# EAGLE design prototype (EAGLE 6.5.0)
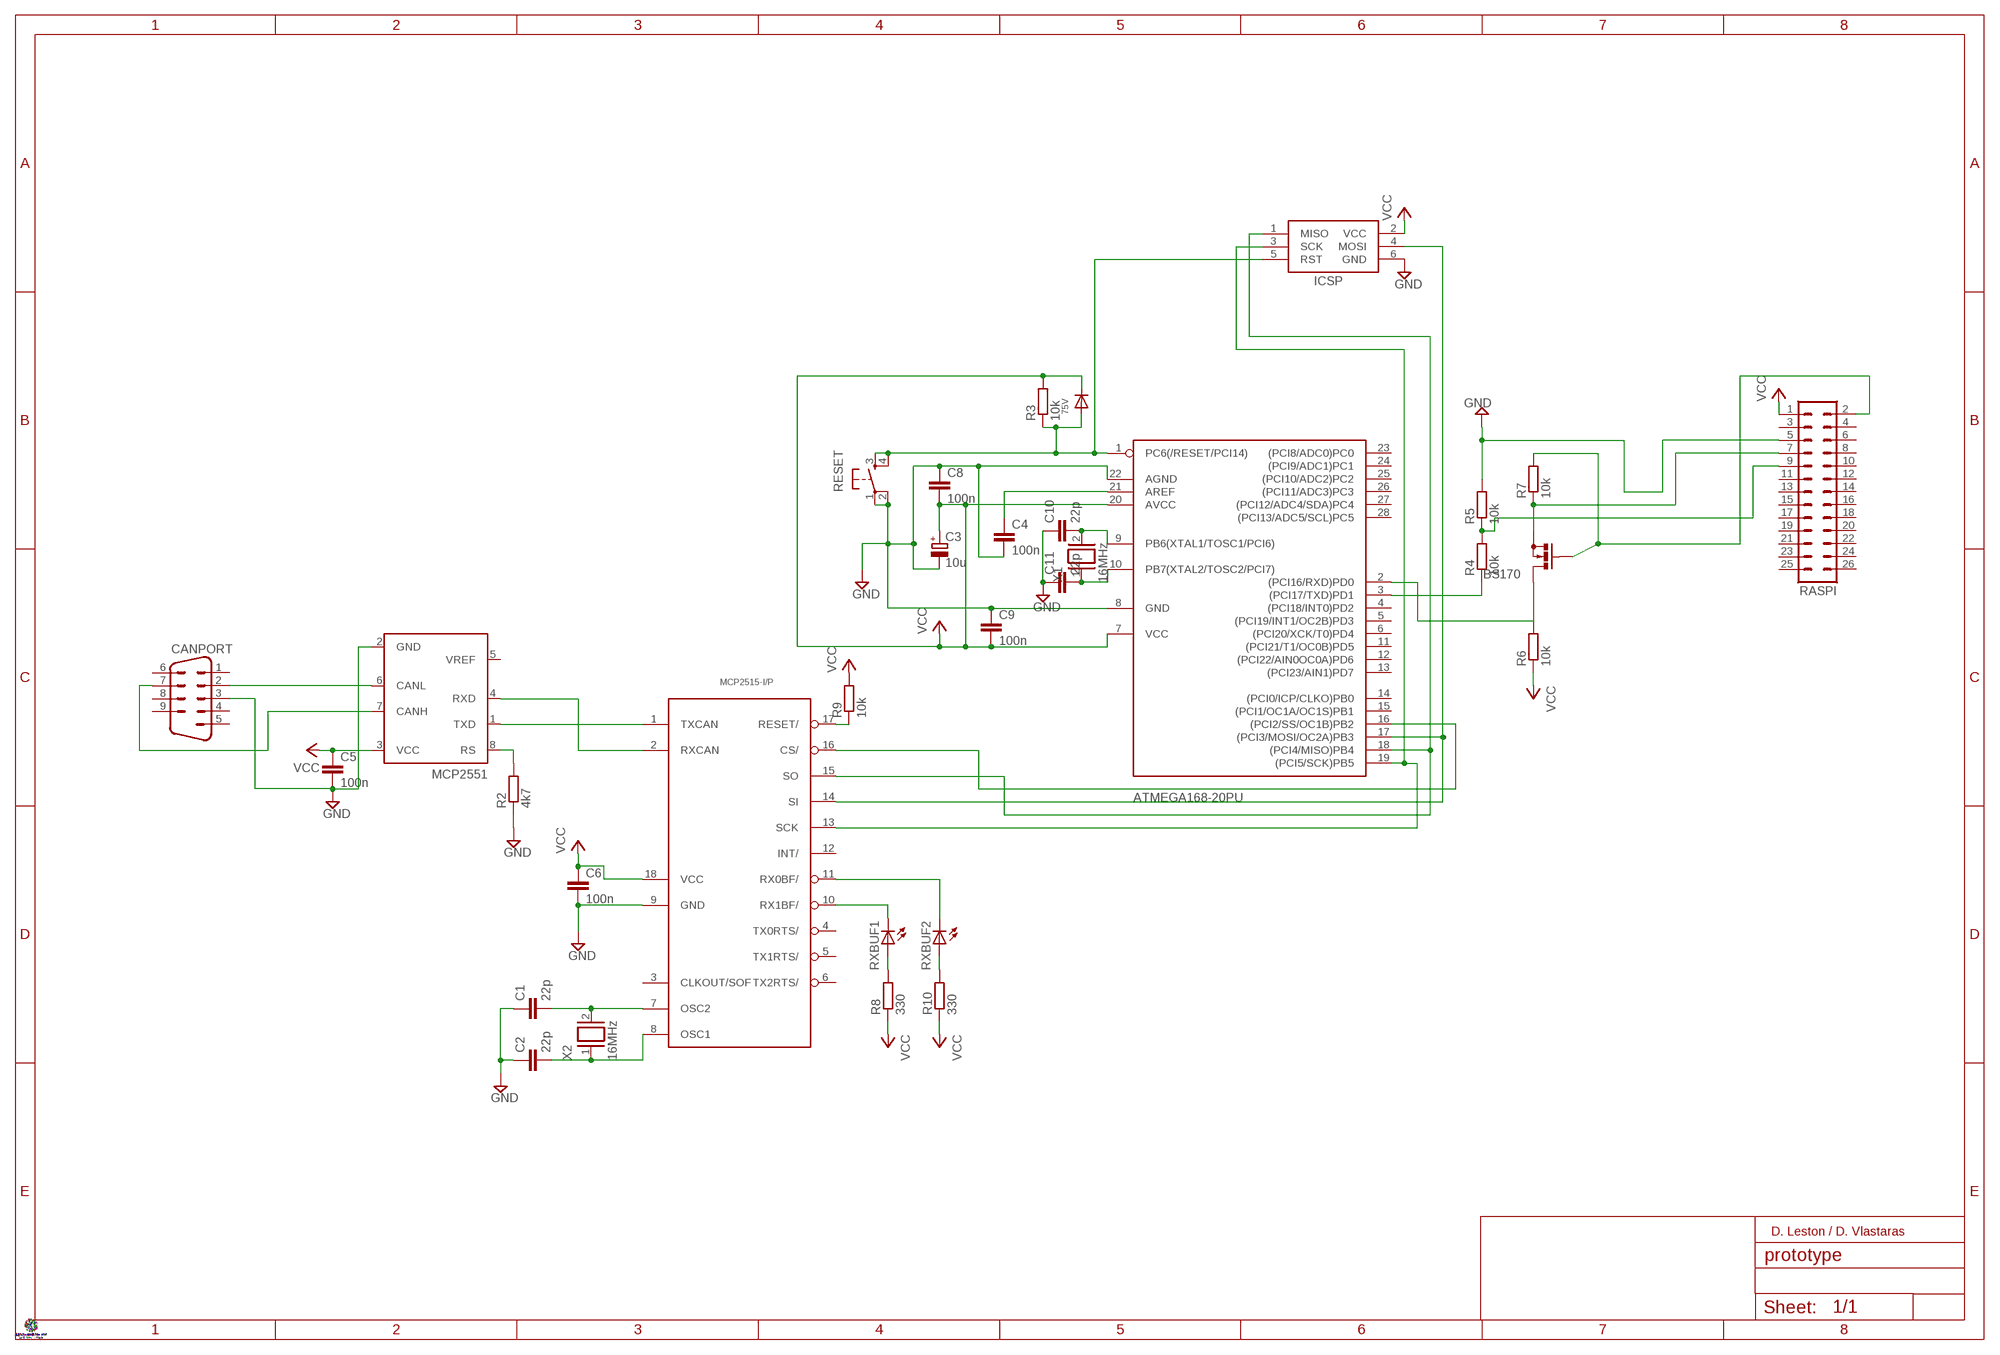
[diagram p0: schematic, sheet 1]

## Parts
75V  DIODEDO-1N4148  [DO-1N4148]
ATMEGA168-20PU  ATMEGA168V-10P  [DIL28-3]
BS170  BS170  [SOT54E]
C1  22p  C-EU050-025X075  [C050-025X075]
C2  22p  C-EU050-025X075  [C050-025X075]
C3  10u  CPOL-EUE2-5  [E2-5]
C4  100n  C-EU050-025X075  [C050-025X075]
C5  100n  C-EU050-025X075  [C050-025X075]
C6  100n  C-EU050-025X075  [C050-025X075]
C8  100n  C-EU050-025X075  [C050-025X075]
C9  100n  C-EU050-025X075  [C050-025X075]
C10  22p  C-EU050-025X075  [C050-025X075]
C11  22p  C-EU050-025X075  [C050-025X075]
CANPORT  M09VP  [M09VP]
ICSP  AVRISP-6  [AVRISP]
MCP2515-I/P  MCP2515DIL  [DIL18]
MCP2551  PCA82C250  [DIL08]
R2  4k7  R-EU_0204/7  [0204/7]
R3  10k  R-EU_0204/7  [0204/7]
R4  10k  R-EU_0204/7  [0204/7]
R5  10k  R-EU_0204/7  [0204/7]
R6  10k  R-EU_0204/7  [0204/7]
R7  10k  R-EU_0204/7  [0204/7]
R8  330  R-EU_0204/7  [0204/7]
R9  10k  R-EU_0204/7  [0204/7]
R10  330  R-EU_0204/7  [0204/7]
RASPI  MA13-2  [MA13-2]
RESET  DTS-6  [DTS-6]
RXBUF1  LED5MM  [LED5MM]
RXBUF2  LED5MM  [LED5MM]
X1  16MHz  XTAL/S  [QS]
X2  16MHz  XTAL/S  [QS]

## Nets
GND: ATMEGA168-20PU.8(GND) ATMEGA168-20PU.22(AGND) C1.1 C2.1 C3.- C4.2 C5.2 C6.2 C8.1 C9.1 C10.1 C11.1 CANPORT.3 ICSP.6(GND) MCP2515-I/P.9(GND) MCP2551.2(GND) R2.1 R5.2 RASPI.5 RESET.1 RESET.2
N$1: MCP2515-I/P.1(TXCAN) MCP2551.1(TXD)
N$2: MCP2515-I/P.2(RXCAN) MCP2551.4(RXD)
N$3: C1.2 MCP2515-I/P.7(OSC2) X2.2
N$4: C2.2 MCP2515-I/P.8(OSC1) X2.1
N$5: MCP2515-I/P.17(RESET/) R9.1
N$6: R8.2 RXBUF1.A
N$7: R10.2 RXBUF2.A
N$8: MCP2515-I/P.11(RX0BF/) RXBUF2.K(C)
N$9: MCP2515-I/P.10(RX1BF/) RXBUF1.K(C)
N$10: ATMEGA168-20PU.16((PCI2/SS/OC1B)PB2) MCP2515-I/P.16(CS/)
N$11: ATMEGA168-20PU.3((PCI17/TXD)PD1) R4.1
N$15: ATMEGA168-20PU.19((PCI5/SCK)PB5) ICSP.3(SCK) MCP2515-I/P.13(SCK)
N$16: ATMEGA168-20PU.9(PB6(XTAL1/TOSC1/PCI6)) C10.2 X1.2
N$17: ATMEGA168-20PU.10(PB7(XTAL2/TOSC2/PCI7)) C11.2 X1.1
N$18: MCP2551.8(RS) R2.2
N$19: ATMEGA168-20PU.21(AREF) C4.1
N$22: R4.2 R5.1 RASPI.9
N$23: ATMEGA168-20PU.2((PCI16/RXD)PD0) BS170.D R6.2
N$24: 75V.A ATMEGA168-20PU.1(PC6(/RESET/PCI14)) ICSP.5(RST) R3.1 RESET.3 RESET.4
N$25: BS170.G R7.2 RASPI.2
N$26: ATMEGA168-20PU.18((PCI4/MISO)PB4) ICSP.1(MISO) MCP2515-I/P.15(SO)
N$27: ATMEGA168-20PU.17((PCI3/MOSI/OC2A)PB3) ICSP.4(MOSI) MCP2515-I/P.14(SI)
N$29: CANPORT.2 MCP2551.6(CANL)
N$30: CANPORT.7 MCP2551.7(CANH)
N$32: BS170.S R7.1 RASPI.7
VCC: 75V.C ATMEGA168-20PU.7(VCC) ATMEGA168-20PU.20(AVCC) C3.+ C5.1 C6.1 C8.2 C9.2 ICSP.2(VCC) MCP2515-I/P.18(VCC) MCP2551.3(VCC) R3.2 R6.1 R8.1 R9.2 R10.1 RASPI.1
Unconnected: ATMEGA168-20PU.4((PCI18/INT0)PD2) ATMEGA168-20PU.5((PCI19/INT1/OC2B)PD3) ATMEGA168-20PU.6((PCI20/XCK/T0)PD4) ATMEGA168-20PU.11((PCI21/T1/OC0B)PD5) ATMEGA168-20PU.12((PCI22/AIN0OC0A)PD6) ATMEGA168-20PU.13((PCI23/AIN1)PD7) ATMEGA168-20PU.14((PCI0/ICP/CLKO)PB0) ATMEGA168-20PU.15((PCI1/OC1A/OC1S)PB1) ATMEGA168-20PU.23((PCI8/ADC0)PC0) ATMEGA168-20PU.24((PCI9/ADC1)PC1) ATMEGA168-20PU.25((PCI10/ADC2)PC2) ATMEGA168-20PU.26((PCI11/ADC3)PC3) ATMEGA168-20PU.27((PCI12/ADC4/SDA)PC4) ATMEGA168-20PU.28((PCI13/ADC5/SCL)PC5) CANPORT.1 CANPORT.4 CANPORT.5 CANPORT.6 CANPORT.8 CANPORT.9 MCP2515-I/P.3(CLKOUT/SOF) MCP2515-I/P.4(TX0RTS/) MCP2515-I/P.5(TX1RTS/) MCP2515-I/P.6(TX2RTS/) MCP2515-I/P.12(INT/) MCP2551.5(VREF) RASPI.3 RASPI.4 RASPI.6 RASPI.8 RASPI.10 RASPI.11 RASPI.12 RASPI.13 RASPI.14 RASPI.15 RASPI.16 RASPI.17 RASPI.18 RASPI.19 RASPI.20 RASPI.21 RASPI.22 RASPI.23 RASPI.24 RASPI.25 RASPI.26

## Library data of the parts
75V = adafruit:DIODE: Diode SMADIODE - SMA Surface Mount Package 20V 1A Schottky Diode Digikey: 641-1014-6-ND DO-1N4148 - Through Hole Small Current Diode SOD-123 20V 1 A (.5mV Vf) Schottky Diode - Digikey: MBRX120TPMSCT-ND SOD-323 10V 570mA (.38mV Vf, 3ns) Schottky Diode - Digikey: ZLLS410CT-ND SOD-523 30V 30mA Schottky Diode (RB751S-40TE61) - Digikey: RB751S-40TE61CT-ND SOT23-R/W - SOT23 Package (R = Solder Paste/Reflow Ovens, W = Hand-Soldering) BAT54Film 40V 300mA - Digikey: 497-7162-1-ND
ATMEGA168-20PU = adafruit:ATMEGA168*P: MICROCONTROLLER 16 kBytes FLASH 1 kBytes SRAM 512 Bytes EEPROM USART 8-channel 10 bit ADC
BS170 = transistor-small-signal:BS170: N-CHANNEL MOS FET
C1 C2 C4-C6 C8-C11 = rcl:C-EU: CAPACITOR, European symbol
C3 = rcl:CPOL-EU: POLARIZED CAPACITOR, European symbol
CANPORT = con-subd:M09: SUB-D; OC_FARNELL: unknown; OC_NEWARK: unknown
ICSP = adafruit:AVRISP: AVR ISP HEADER Standard 6 pin header for AVR programming
MCP2515-I/P = MCP2515_MT:MCP2515*: MCP2515 Standalone CAN-Controller by Microchip Eagle-Lib. by MartinThomas
MCP2551 = micro-philips:PCA82C250: CAN CONTROLLER INTERFACE; OC_FARNELL: 3692358; OC_NEWARK: unknown
R2-R10 = rcl:R-EU_: RESISTOR, European symbol
RASPI = con-lstb:MA13-2: PIN HEADER; OC_FARNELL: unknown; OC_NEWARK: unknown
RESET = switch-tact:DTS-6
RXBUF1 RXBUF2 = led:LED: LED OSRAM: - CHIPLED LG R971, LG N971, LY N971, LG Q971, LY Q971, LO R971, LY R971 LH N974, LH R974 LS Q976, LO Q976, LY Q976 LO Q996 - Hyper CHIPLED LW Q18S LB Q993, LB Q99A, LB R99A - SideLED LS A670, LO A670, LY A670, LG A670, LP A670 LB A673, LV A673, LT A673, LW A673 LH A674 LY A675 LS A676, LA A676, LO A676, LY A676, LW A676 LS A679, LY A679, LG A679 - Hyper Micro SIDELED® LS Y876, LA Y876, LO Y876, LY Y876 LT Y87S - SmartLED LW L88C, LW L88S LB L89C, LB L89S, LG L890 LS L89K, LO L89K, LY L89K LS L896, LA L896, LO L896, LY L896 - TOPLED LS T670, LO T670, LY T670, LG T670, LP T670 LSG T670, LSP T670, LSY T670, LOP T670, LYG T670 LG T671, LOG T671, LSG T671 LB T673, LV T673, LT T673, LW T673 LH T674 LS T676, LA T676, LO T676, LY T676, LB T676, LH T676, LSB T676, LW T676 LB T67C, LV T67C, LT T67C, LS T67K, LO T67K, LY T67K, LW E67C LS E67B, LA E67B, LO E67B, LY E67B, LB E67C, LV E67C, LT E67C LW T67C LS T679, LY T679, LG T679 LS T770, LO T770, LY T770, LG T770, LP T770 LB T773, LV T773, LT T773, LW T773 LH T774 LS E675, LA E675, LY E675, LS T675 LS T776, LA T776, LO T776, LY T776, LB T776 LHGB T686 LT T68C, LB T68C - Hyper Mini TOPLED® LB M676 - Mini TOPLED Santana® LG M470 LS M47K, LO M47K, LY M47K Source: http://www.osram.convergy.de LUXEON: - LUMILED® LXK2-PW12-R00, LXK2-PW12-S00, LXK2-PW14-U00, LXK2-PW14-V00 LXK2-PM12-R00, LXK2-PM12-S00, LXK2-PM14-U00 LXK2-PE12-Q00, LXK2-PE12-R00, LXK2-PE12-S00, LXK2-PE14-T00, LXK2-PE14-U00 LXK2-PB12-K00, LXK2-PB12-L00, LXK2-PB12-M00, LXK2-PB14-N00, LXK2-PB14-P00, LXK2-PB14-Q00 LXK2-PR12-L00, LXK2-PR12-M00, LXK2-PR14-Q00, LXK2-PR14-R00 LXK2-PD12-Q00, LXK2-PD12-R00, LXK2-PD12-S00 LXK2-PH12-R00, LXK2-PH12-S00 LXK2-PL12-P00, LXK2-PL12-Q00, LXK2-PL12-R00 Source: www.luxeon.com KINGBRIGHT: KA-3528ASYC Source: www.kingbright.com
X1 X2 = special:XTAL/S: CRYSTAL

## Board
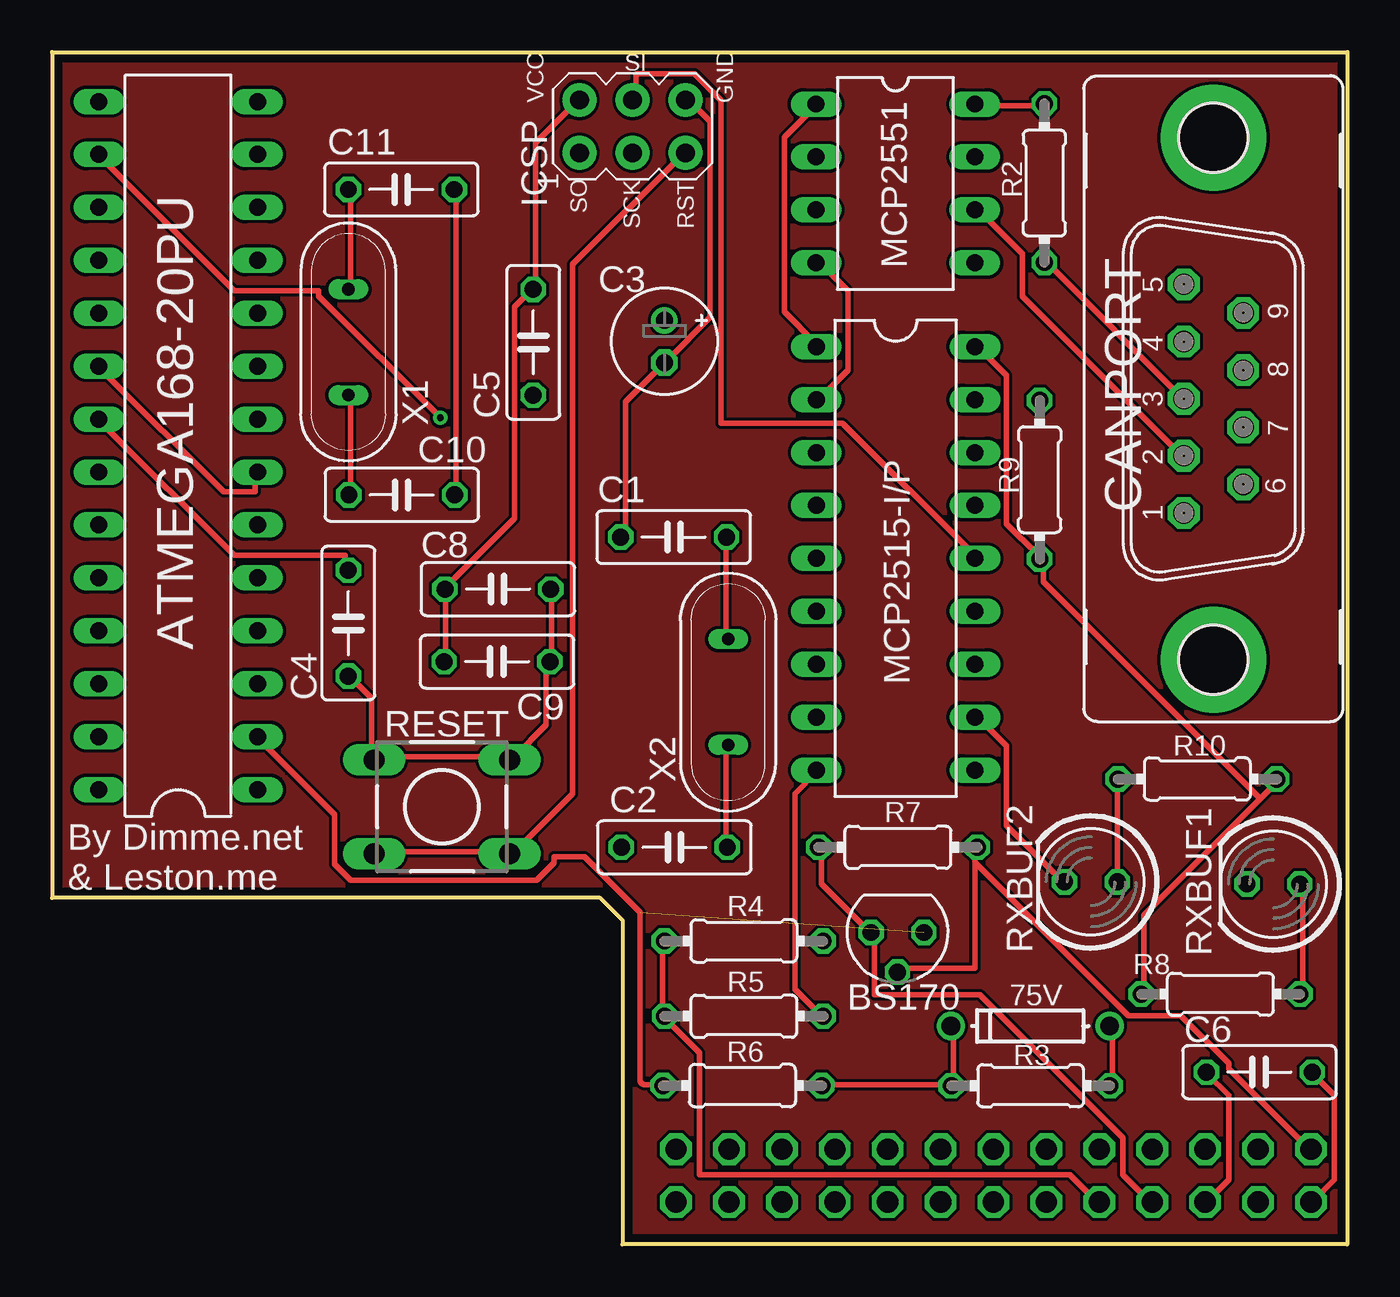
[diagram p1: board, top side]
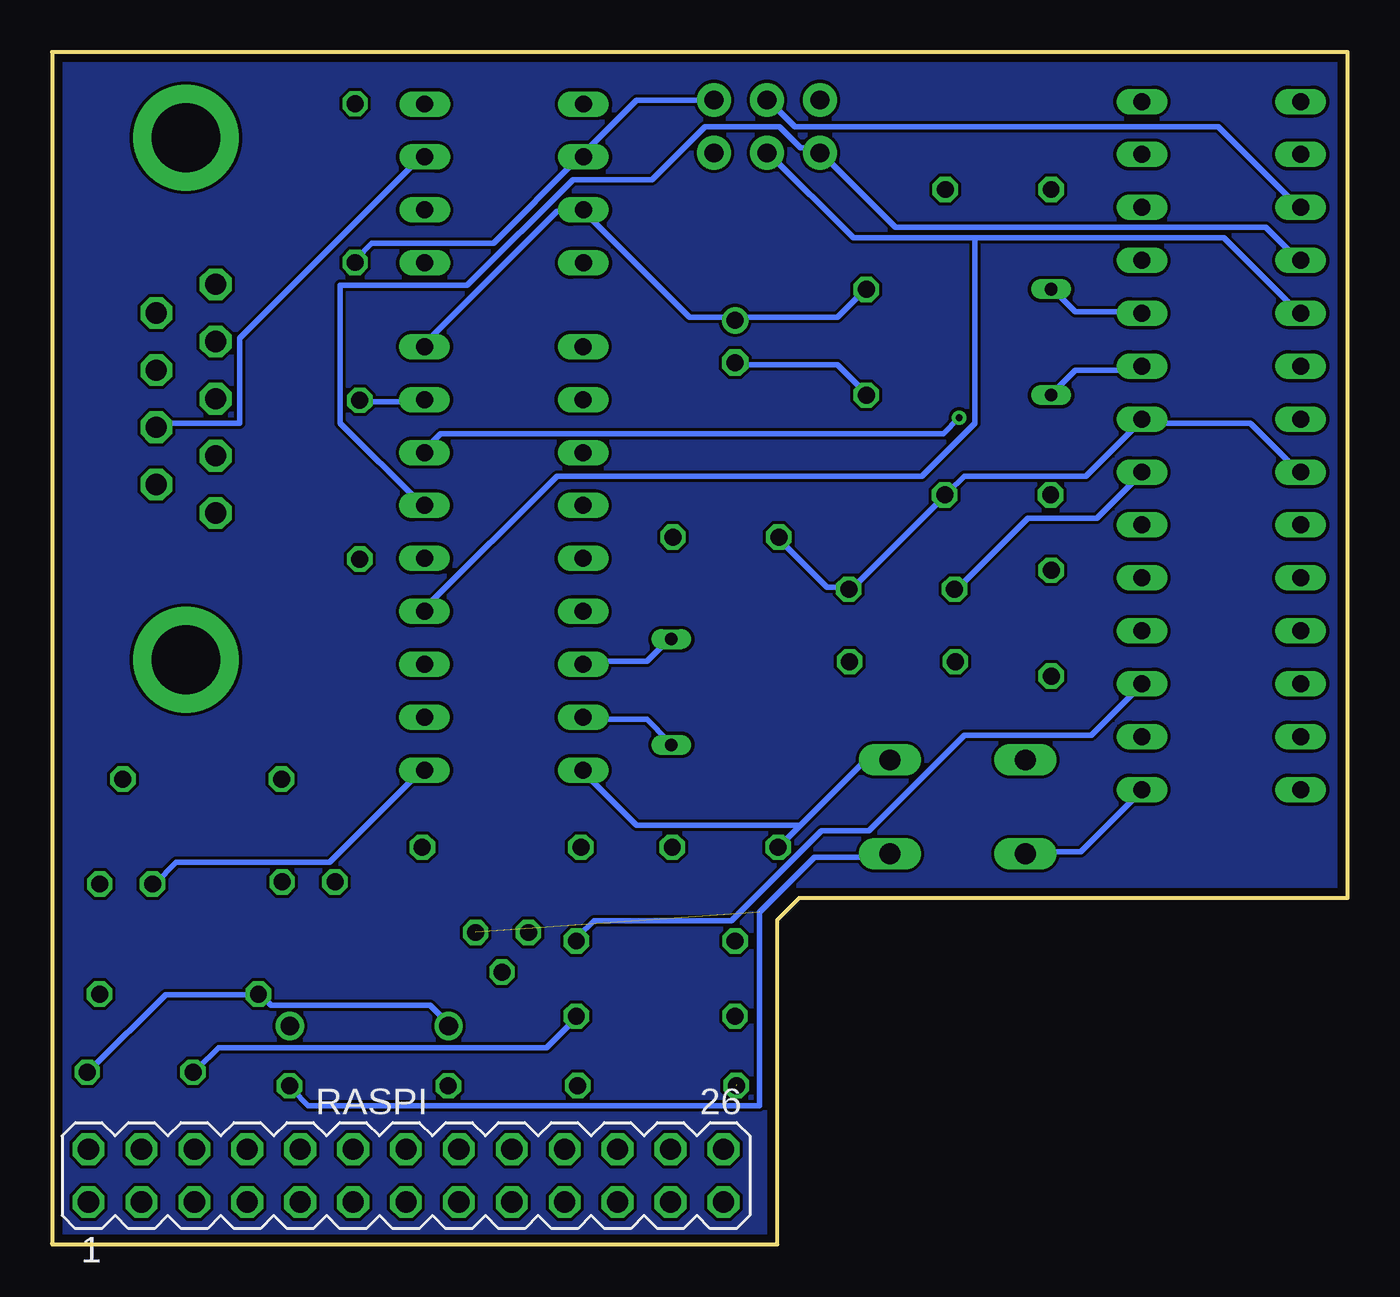
[diagram p2: board, bottom side, seen from below]

Size 62.19 x 57.23 mm. Coordinates in mm from the lower left corner, seen from the top.
Outline: 0,57.23 62.19,57.23 62.19,0.05
Outline: 62.18,0 27.38,0 27.38,15.57 26.31,16.64 0,16.64 0,57.2
Copper layers (1*16): Top 0.0356mm / dielectric 1.5011mm / Bottom 0.0356mm
Design rules "LaenPCBOrder *": minimum track width 10mil, minimum drill 13mil, track to track 6mil, track to pad 6mil, pad to pad 6mil, via to via 6mil, smd to smd 6mil, copper to edge 15mil, drill to drill 6mil, minimum pad ring 7mil, minimum via ring 7mil, stop-mask expansion 3mil, vias tented up to drill 0mil, thermal gap 10mil

### Footprints (pad centres in the part's own frame; a part is rotated, then mirrored left to right if it is on the bottom)
DO-1N4148 = drill 0.9: A -3.81,0; C 3.81,0
DIL28-3 = drill 0.813 long: 1 -16.51,-3.81; 2 -13.97,-3.81; 3 -11.43,-3.81; 4 -8.89,-3.81; 5 -6.35,-3.81; 6 -3.81,-3.81; 7 -1.27,-3.81; 8 1.27,-3.81; 9 3.81,-3.81; 10 6.35,-3.81; 11 8.89,-3.81; 12 11.43,-3.81; 13 13.97,-3.81; 14 16.51,-3.81; 15 16.51,3.81; 16 13.97,3.81; 17 11.43,3.81; 18 8.89,3.81; 19 6.35,3.81; 20 3.81,3.81; 21 1.27,3.81; 22 -1.27,3.81; 23 -3.81,3.81; 24 -6.35,3.81; 25 -8.89,3.81; 26 -11.43,3.81; 27 -13.97,3.81; 28 -16.51,3.81
SOT54E = drill 0.813 octagon: D -1.27,0; G 0,1.905; S 1.27,0
C050-025X075 = drill 0.813 octagon: 1 -2.54,0; 2 2.54,0
E2-5 = drill 0.813 pad 1.27: + -1.016,0 | drill 0.813 pad 1.27 octagon: - 1.016,0
M09VP = drill 1.016 octagon: 1 -5.486,1.422; 2 -2.743,1.422; 3 0,1.422; 4 2.743,1.422; 5 5.486,1.422; 6 -4.115,-1.422; 7 -1.372,-1.422; 8 1.372,-1.422; 9 4.115,-1.422 | drill 3.302 pad 5.08: G1 -12.522,0; G2 12.522,0
AVRISP = drill 0.9 pad 1.626: 1 -1.27,2.54; 2 1.27,2.54; 3 -1.27,0; 4 1.27,0; 5 -1.27,-2.54; 6 1.27,-2.54
DIL18 = drill 0.813 long: 1 -10.16,-3.81; 2 -7.62,-3.81; 3 -5.08,-3.81; 4 -2.54,-3.81; 5 0,-3.81; 6 2.54,-3.81; 7 5.08,-3.81; 8 7.62,-3.81; 9 10.16,-3.81; 10 10.16,3.81; 11 7.62,3.81; 12 5.08,3.81; 13 2.54,3.81; 14 0,3.81; 15 -2.54,3.81; 16 -5.08,3.81; 17 -7.62,3.81; 18 -10.16,3.81
DIL08 = drill 0.813 long: 1 -3.81,-3.81; 2 -1.27,-3.81; 3 1.27,-3.81; 4 3.81,-3.81; 5 3.81,3.81; 6 1.27,3.81; 7 -1.27,3.81; 8 -3.81,3.81
0204/7 = drill 0.813 octagon: 1 -3.81,0; 2 3.81,0
MA13-2 = drill 1.016 octagon: 1 -15.24,-1.27; 2 -15.24,1.27; 3 -12.7,-1.27; 4 -12.7,1.27; 5 -10.16,-1.27; 6 -10.16,1.27; 7 -7.62,-1.27; 8 -7.62,1.27; 9 -5.08,-1.27; 10 -5.08,1.27; 11 -2.54,-1.27; 12 -2.54,1.27; 13 0,-1.27; 14 0,1.27; 15 2.54,-1.27; 16 2.54,1.27; 17 5.08,-1.27; 18 5.08,1.27; 19 7.62,-1.27; 20 7.62,1.27; 21 10.16,-1.27; 22 10.16,1.27; 23 12.7,-1.27; 24 12.7,1.27; 25 15.24,-1.27; 26 15.24,1.27
DTS-6 = drill 1 long: 1 -3.25,2.25; 2 3.25,2.25; 3 -3.25,-2.25; 4 3.25,-2.25
LED5MM = drill 0.813 octagon: A -1.27,0; K 1.27,0
QS = drill 0.61 long: 1 -2.54,0; 2 2.54,0

### Placement (x,y rotation side)
75V  46.96,10.48 180 top
ATMEGA168-20PU  6.06,38.34 90 top
BS170  40.59,14.97 180 top
C1  29.84,33.95 0 top
C2  29.87,19.06 0 top
C3  29.4,43.34 270 top
C4  14.22,29.82 270 top
C5  23.1,43.3 270 top
C6  57.96,8.27 180 top
C8  21.4,31.45 180 top
C9  21.36,27.97 180 top
C10  16.79,35.98 180 top
C11  16.77,50.63 180 top
CANPORT  55.76,40.59 90 top
ICSP  27.87,53.66 90 top
MCP2515-I/P  40.5,32.93 270 top
MCP2551  40.49,50.92 270 top
R2  47.64,50.94 90 top
R3  46.98,7.62 180 top
R4  33.21,14.56 180 top
R5  33.21,10.95 0 top
R6  33.15,7.62 180 top
R7  40.61,19.06 0 top
R8  56.1,12.01 0 top
R9  47.42,36.7 270 top
R10  54.98,22.34 180 top
RASPI  45.2,3.3 0 bottom
RESET  18.72,21 0 top
RXBUF1  58.63,17.3 180 top
RXBUF2  49.87,17.4 180 top
X1  14.22,43.31 270 top
X2  32.46,26.52 90 top

### Tracks (layer width: path | path; a pad name or v marks a point on that pad's centre or on a via)
GND
  Top 0.254: C6.2 55.47,8.18 56.49,7.16 56.49,3.1 55.47,2.08 RASPI.5 | C4.2 14.33,27.23 15.34,26.21 15.34,23.42 RESET.1 15.6,23.42 21.95,23.42 RESET.2 22.2,23.42 23.72,24.94 23.72,27.74 C9.1 23.98,27.99 23.98,31.29 C8.1 | R5.2 36.93,10.97 35.66,12.24 35.66,21.64 36.68,22.66 MCP2515-I/P.9 | R2.1 47.85,47.04 54.2,40.69 CANPORT.3 | C11.1 19.41,50.6 19.41,36.12 C10.1 | C1.1 27.53,34.09 27.53,40.44 29.31,42.21 C3.- 29.57,42.47 31.6,44.5 31.6,53.9 30.58,54.91 ICSP.6
  Bottom 0.254: 26.26,20.12 23.22,23.16 22.2,23.16 RESET.2 | 26.26,20.12 27.28,19.1 C2.1 | 26.26,20.12 34.14,20.12 36.68,22.66 MCP2515-I/P.9 | C6.2 55.22,8.43 54.2,9.45 38.46,9.45 37.19,10.72 R5.2 | ICSP.6 30.58,54.91 34.14,54.91 36.68,52.37 MCP2551.2 36.93,52.12 41,48.06 46.84,48.06 47.6,47.29 R2.1 | ATMEGA168-20PU.22 2.39,37.13 4.67,39.42 9.75,39.42 ATMEGA168-20PU.8 10.01,39.42 12.55,36.88 18.39,36.88 19.15,36.12 C10.1 19.41,35.86 23.72,31.55 C8.1 23.98,31.55 24.99,31.55 27.28,33.83 C1.1 | C5.2 23.22,40.94 24.49,42.21 29.31,42.21 C3.-
N$1
  Top 0.254: MCP2515-I/P.1 36.68,43.23 35.15,44.75 35.15,53.14 36.68,54.66 MCP2551.1
N$2
  Top 0.254: MCP2551.4 36.93,47.04 38.2,45.77 38.2,41.96 36.93,40.69 MCP2515-I/P.2
N$3
  Top 0.254: C1.2 32.36,33.83 32.36,29.26 X2.2
  Bottom 0.254: X2.2 32.61,29.01 33.63,27.99 36.68,27.99 MCP2515-I/P.7
N$4
  Top 0.254: C2.2 32.36,19.1 32.36,23.93 X2.1
  Bottom 0.254: X2.1 32.61,24.18 33.63,25.2 36.68,25.2 MCP2515-I/P.8
N$5
  Bottom 0.254: R9.1 47.35,40.44 44.55,40.44 MCP2515-I/P.17
N$6
  Top 0.254: RXBUF1.A 60.05,17.07 60.05,12.24 R8.2
N$7
  Top 0.254: RXBUF2.A 51.16,17.58 51.16,22.15 R10.2
N$8
  Top 0.254: RXBUF2.K 48.36,17.58 45.82,20.12 45.82,23.93 44.55,25.2 MCP2515-I/P.11
N$9
  Bottom 0.254: MCP2515-I/P.10 44.55,22.66 48.87,18.34 56.24,18.34 57.25,17.32 RXBUF1.K
N$10  (via drill 0.33)
  Top 0.254: v18.64,39.67 12.8,45.52 12.8,45.77 8.74,45.77 2.39,52.12 ATMEGA168-20PU.16
  Bottom 0.254: v18.64,39.67 19.41,38.91 43.54,38.91 44.3,38.15 MCP2515-I/P.16
N$11
  Bottom 0.254: ATMEGA168-20PU.3 10.01,26.72 12.29,24.43 18.39,24.43 22.96,19.86 25.25,19.86 29.57,15.54 36.17,15.54 36.93,14.78 R4.1
N$12
  pour Top: 0.1,17.5 0.79,16.81 26.39,16.81 27.51,15.7 27.51,0.84 28.24,0.1 61.47,0.1 62.05,0.69 62.05,56.54 61.47,57.12 0.79,57.12 0.13,56.46
N$13
  pour Bottom: 0.13,56.44 0.13,17.48 0.84,16.76 26.37,16.76 27.51,15.62 27.51,0.84 28.27,0.08 61.44,0.08 62.1,0.74 62.1,56.49 61.47,57.12 0.79,57.12 0.13,56.46
N$15
  Bottom 0.254: 17.88,48.31 23.72,48.31 27.79,52.37 ICSP.3 | 17.88,48.31 5.94,48.31 2.39,44.75 ATMEGA168-20PU.19 | 17.88,48.31 17.88,39.42 20.42,36.88 37.95,36.88 44.3,30.53 MCP2515-I/P.13
N$16
  Top 0.254: C10.2 14.33,36.12 14.33,40.69 X1.2
  Bottom 0.254: X1.2 14.07,40.94 13.06,41.96 10.01,41.96 ATMEGA168-20PU.9
N$17
  Top 0.254: C11.2 14.33,50.6 14.33,46.02 X1.1
  Bottom 0.254: X1.1 14.07,45.77 13.06,44.75 10.01,44.75 ATMEGA168-20PU.10
N$18
  Top 0.254: MCP2551.8 44.55,54.66 47.6,54.66 R2.2
N$19
  Top 0.254: ATMEGA168-20PU.21 2.39,39.42 8.74,33.07 14.07,33.07 14.07,32.56 C4.1
N$22
  Top 0.254: R4.2 29.31,14.53 29.31,10.97 R5.1 29.57,10.72 31.09,9.19 31.09,3.35 48.87,3.35 50.14,2.08 RASPI.9
N$23  (2 unrouted)
  Top 0.254: ATMEGA168-20PU.2 10.01,24.18 13.56,20.62 13.56,18.24 14.33,17.48 23.27,17.48 24.1,18.31 24.1,18.62 25.55,18.62 28.22,15.95 28.22,7.92 arc90 28.47,7.67 29.31,7.67
N$24
  Top 0.254: R3.1 50.9,7.67 50.9,10.46 75V.A | RESET.3 15.6,18.85 21.95,18.85 RESET.4 22.2,18.85 24.99,21.64 24.99,47.04 30.33,52.37 ICSP.5
  Bottom 0.254: ATMEGA168-20PU.1 10.01,21.64 12.8,18.85 15.34,18.85 RESET.3 | R3.1 50.65,7.42 49.89,6.65 28.22,6.65 28.22,15.95 25.58,18.59 22.2,18.59 RESET.4
N$25
  Top 0.254: 44.3,18.34 44.3,18.85 R7.2 | 44.3,18.34 44.3,13.26 40.74,13.26 BS170.G | 44.3,18.34 51.66,10.97 54.2,10.97 56.49,8.69 56.49,8.43 60.3,4.62 RASPI.2
N$26
  Bottom 0.254: ATMEGA168-20PU.18 2.39,47.29 3.91,48.82 21.69,48.82 25.25,52.37 ICSP.1 25.5,52.63 26.26,52.63 27.28,53.64 30.84,53.64 33.38,51.1 37.19,51.1 42.27,46.02 48.36,46.02 48.36,39.42 44.55,35.61 MCP2515-I/P.15
N$27
  Top 0.254: MCP2515-I/P.14 44.3,33.07 37.95,39.42 32.11,39.42 32.11,54.91 30.84,56.18 28.04,56.18 28.04,55.17 ICSP.4
  Bottom 0.254: ATMEGA168-20PU.17 2.39,49.83 6.2,53.64 26.52,53.64 27.79,54.91 ICSP.4
N$29
  Top 0.254: MCP2551.6 44.55,49.58 46.58,47.55 46.58,45.52 54.2,37.9 CANPORT.2
N$30
  Bottom 0.254: MCP2551.7 44.55,52.12 53.19,43.48 53.19,39.42 57,39.42 CANPORT.7
N$32
  Top 0.254: R7.1 36.93,18.85 36.93,17.32 39.22,15.04 BS170.S 39.47,14.78 39.47,11.99 44.55,11.99 51.41,5.13 51.41,3.35 52.68,2.08 RASPI.7
VCC
  Top 0.254: 75V.C 43.28,10.46 43.28,7.67 R3.2 43.03,7.67 37.19,7.67 R6.1 | 58.01,21.39 52.43,15.8 52.43,12.24 R8.1 | 58.01,21.39 58.78,22.15 R10.1 | RASPI.1 60.55,2.08 61.57,3.1 61.57,7.16 60.55,8.18 C6.1 | C9.2 18.9,27.99 18.9,31.29 C8.2 18.9,31.55 22.2,34.85 22.2,45.01 22.96,45.77 C5.1 23.22,46.02 23.22,52.88 25.25,54.91 ICSP.2 25.5,54.91 | ATMEGA168-20PU.20 2.39,41.96 8.23,36.12 9.75,36.12 9.75,36.88 ATMEGA168-20PU.7 | MCP2515-I/P.18 44.55,42.98 45.82,41.71 45.82,34.59 47.35,33.07 R9.2 47.6,32.82 47.6,31.8 58.01,21.39
  Bottom 0.254: 75V.C 43.28,10.72 44.04,11.48 51.66,11.48 52.17,11.99 R8.1 52.43,11.99 56.74,11.99 60.3,8.43 C6.1 | C8.2 18.64,31.55 15.34,34.85 12.04,34.85 10.01,36.88 ATMEGA168-20PU.7 | C5.1 23.22,45.77 24.49,44.5 29.31,44.5 C3.+ 29.57,44.5 31.6,44.5 36.68,49.58 MCP2551.3 36.93,49.58 37.95,49.58 44.3,43.23 MCP2515-I/P.18

### Text on the board
tPlace: SI | VCC | GND | SO | SCK | RST
tNames: By Dimme.net / & Leston.me